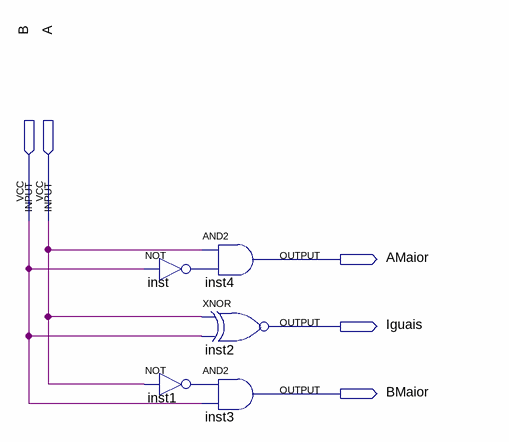
[diagram p0: schematic sheet]
// Quartus schematic MeioComparadordMag.bdf as structural Verilog: 5 symbols, 5 pins
module MeioComparadordMag (
  input  B,
  input  A,
  output AMaior,
  output Iguais,
  output BMaior
);

  wire inst1_out, inst_out;

  not inst (inst_out, B);
  not inst1 (inst1_out, A);
  and inst4 (AMaior, A, inst_out);
  xnor inst2 (Iguais, A, B);
  and inst3 (BMaior, inst1_out, B);
endmodule
